# Altium project K-Line.PrjPcb
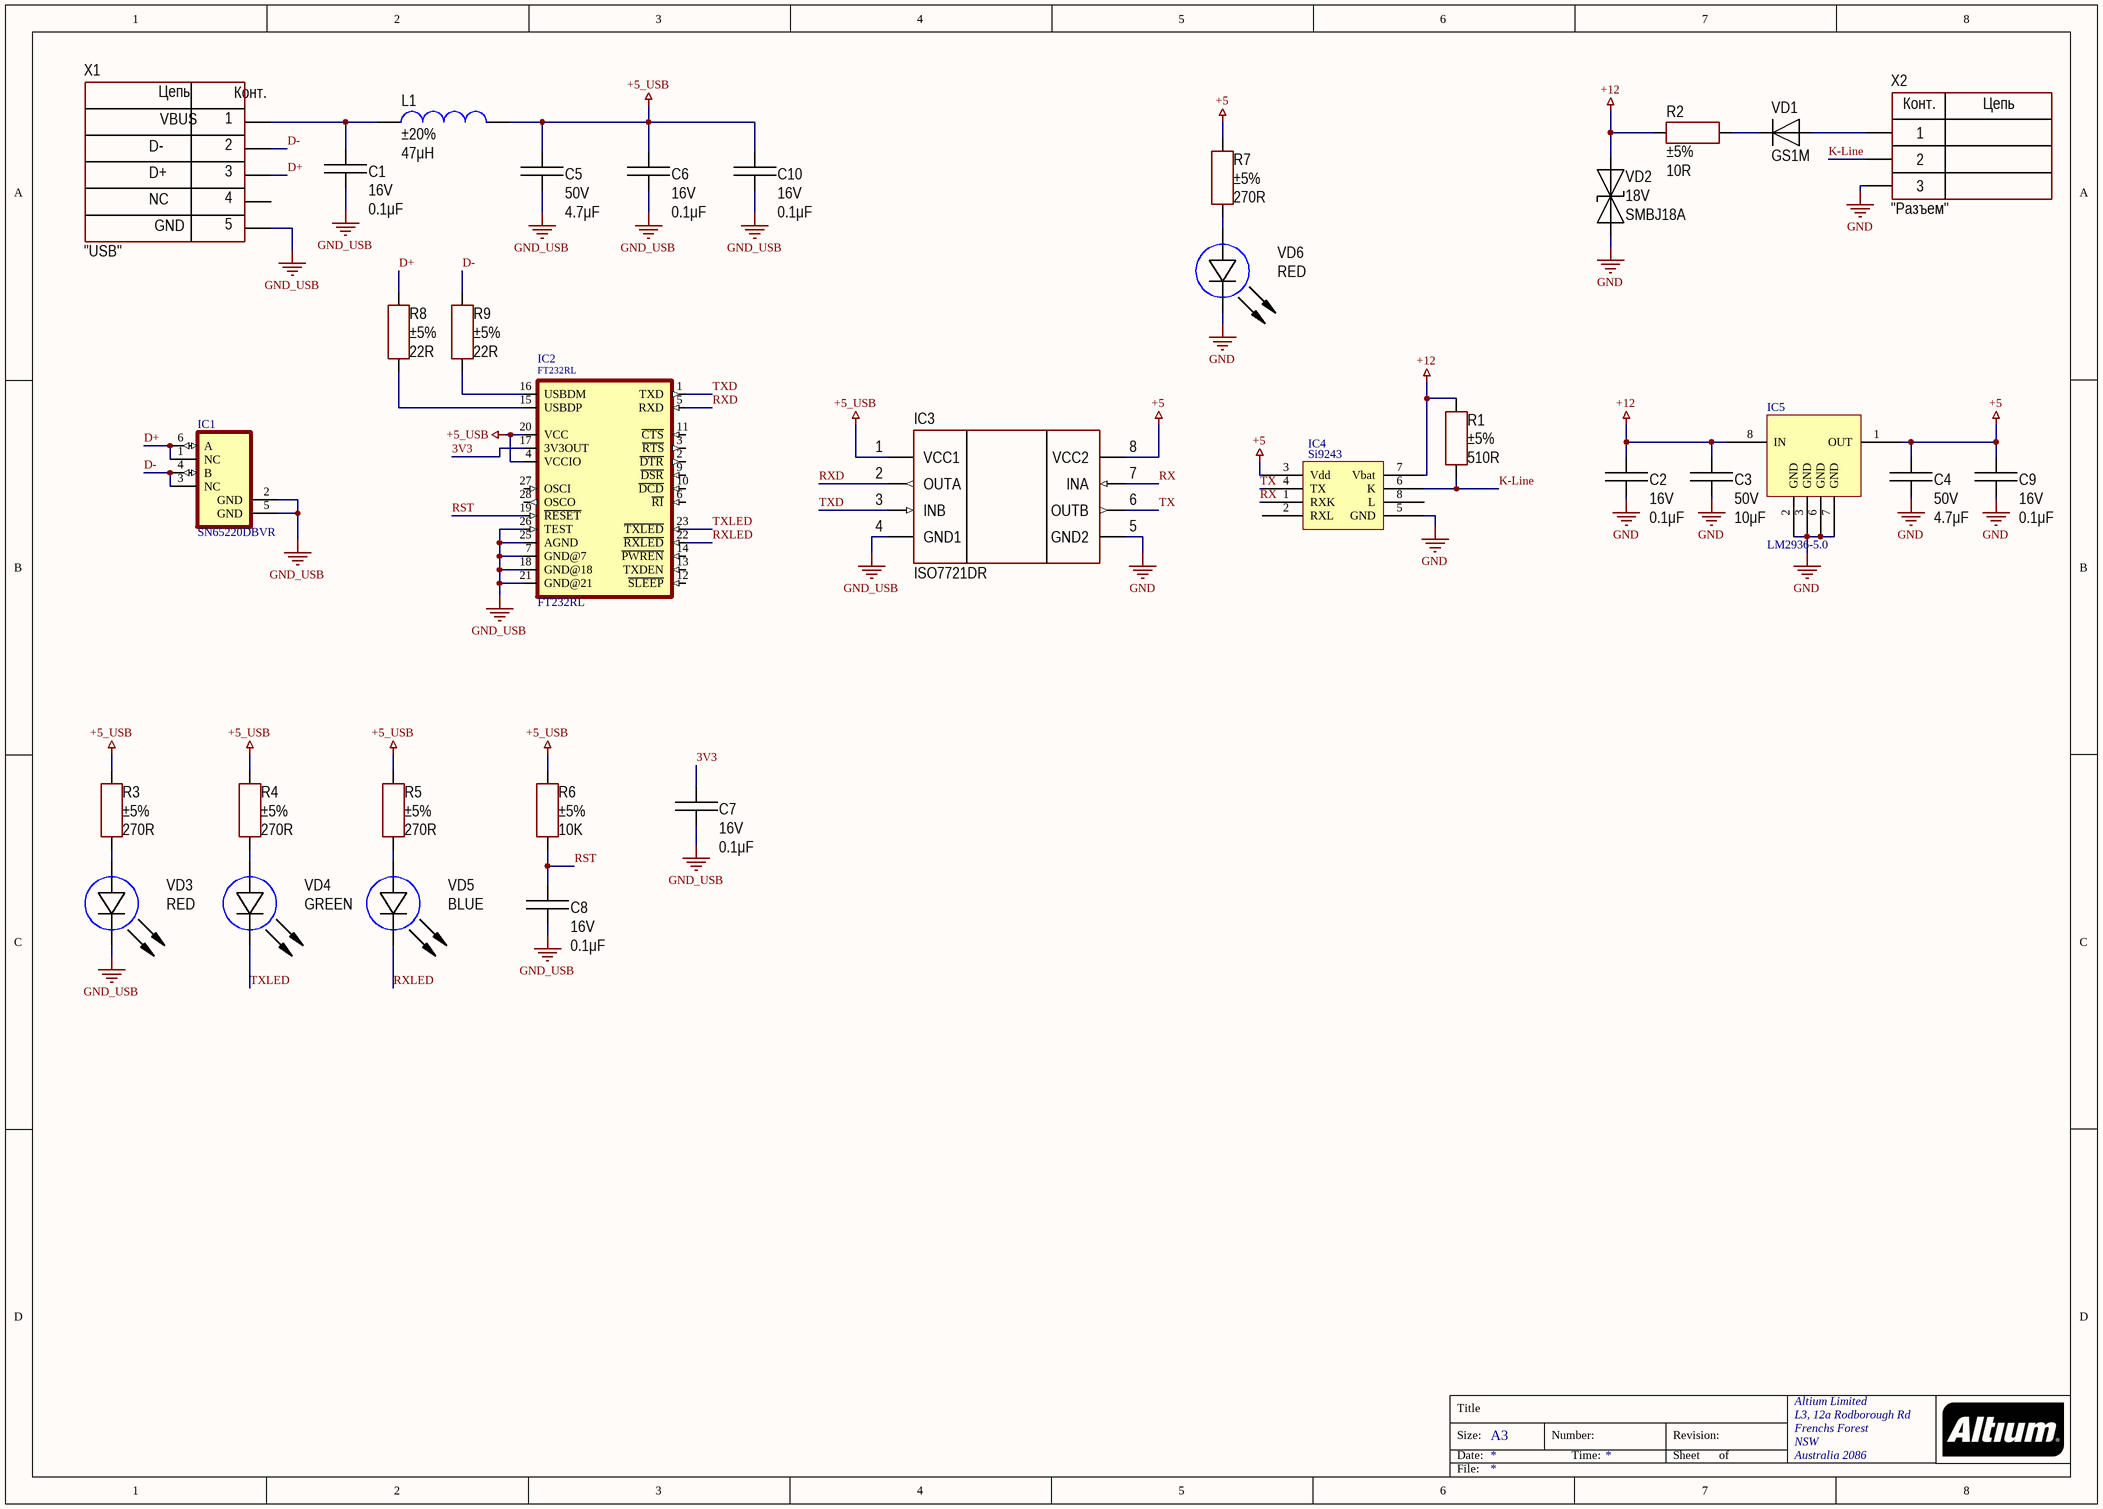
[diagram p0: K-Line.SchDoc]
1 sheet, 33 parts. Net scope: global (net labels, ports and power ports of the same name join across sheets).
Board file: PCB.PcbDoc

## Sheet K-Line.SchDoc
size A3; Organization: Altium Limited; Address1: L3, 12a Rodborough Rd; Address2: Frenchs Forest; Address3: NSW; Address4: Australia 2086

### Parts
C1  value 0.1μF  Voltage: 16V  [CAP: 0805]
C2  value 0.1μF  Voltage: 16V  [CAP: 0805]
C3  value 10μF  Voltage: 50V  [CAP: 1210]
C4  value 4.7μF  Voltage: 50V  [CAP: 1206]
C5  value 4.7μF  Voltage: 50V  [CAP: 1206]
C6  value 0.1μF  Voltage: 16V  [CAP: 0805]
C7  value 0.1μF  Voltage: 16V  [CAP: 0603]
C8  value 0.1μF  Voltage: 16V  [CAP: 0603]
C9  value 0.1μF  Voltage: 16V  [CAP: 0805]
C10  value 0.1μF  Voltage: 16V  [CAP: 0603]
IC1  SN65220DBVR  [SOT23-6]
IC2  FT232RL  [28-SSOP]
IC3  (no value)  [8-SOIC]
IC4  Si9243  [8-SOIC]
IC5  LM2936-5.0  [8-SOIC]
L1  value 47μH  Tolerance: ±20%  [IND: 0805]
R1  value 510R  Tolerance: ±5%  [RES: 2010]
R2  value 10R  Tolerance: ±5%  [RES: 1206]
R3  value 270R  Tolerance: ±5%  [RES: 0603]
R4  value 270R  Tolerance: ±5%  [RES: 0603]
R5  value 270R  Tolerance: ±5%  [RES: 0603]
R6  value 10K  Tolerance: ±5%  [RES: 0603]
R7  value 270R  Tolerance: ±5%  [RES: 0603]
R8  value 22R  Tolerance: ±5%  [RES: 0603]
R9  value 22R  Tolerance: ±5%  [RES: 0603]
VD1  PartNumber: GS1M  [DIODE: SMA]
VD2  Voltage: 18V  PartNumber: SMBJ18A  [DIODE: SMB]
VD3  Color: RED  [LED: 0402B]
VD4  Color: GREEN  [LED: 0402B]
VD5  Color: BLUE  [LED: 0402B]
VD6  Color: RED  [LED: 0402B]
X1  CommentText: "USB"  [CON: 0675031020]
X2  CommentText: "Разъем"  [CON: DG350-3.5-03P]

### Nets
+5: C4.2 C9.2 IC3.8(VCC2) IC4.3(Vdd) IC5.1(OUT) R7.2
+5_USB: C5.2 C6.2 C10.2 IC2.4(VCCIO) IC2.20(VCC) IC3.1(VCC1) L1.1 R3.2 R4.2 R5.2 R6.2
+12: C2.2 C3.2 IC4.7(Vbat) IC5.8(IN) R1.2 R2.1 VD2.2(C)
GND: C2.1 C3.1 C4.1 C9.1 IC3.5(GND2) IC4.5(GND) IC5.2(GND) IC5.3(GND) IC5.6(GND) IC5.7(GND) VD2.1(A) VD6.2(C) X2.3
GND_USB: C1.1 C5.1 C6.1 C7.1 C8.1 C10.1 IC1.2(GND) IC1.5(GND) IC2.7(GND@7) IC2.18(GND@18) IC2.21(GND@21) IC2.25(AGND) IC2.26(TEST) IC3.4(GND1) VD3.2(C) X1.5
3V3: C7.2 IC2.17(3V3OUT)
D+: IC1.1(NC) IC1.6(A) R8.2 X1.3
D-: IC1.3(NC) IC1.4(B) R9.2 X1.2
K-Line: IC4.6(K) R1.1 X2.2
RST: C8.2 IC2.19(~{RESET}) R6.1
RX: IC3.7(INA) IC4.1(RXK)
RXD: IC2.5(RXD) IC3.2(OUTA)
RXLED: IC2.22(~{RXLED}) VD5.2(C)
TX: IC3.6(OUTB) IC4.4(TX)
TXD: IC2.1(TXD) IC3.3(INB)
TXLED: IC2.23(~{TXLED}) VD4.2(C)
NetC1_2: C1.2 L1.2 X1.1
NetIC2_15: IC2.15(USBDP) R8.1
NetIC2_16: IC2.16(USBDM) R9.1
NetR2_2: R2.2 VD1.2
NetR3_1: R3.1 VD3.1(A)
NetR4_1: R4.1 VD4.1(A)
NetR5_1: R5.1 VD5.1(A)
NetR7_1: R7.1 VD6.1(A)
NetVD1_1: VD1.1 X2.1

Not connected (* = marked no-connect by the designer): IC2 2(~{DTR}) 3(~{RTS}) 6(~{RI}) 9(~{DSR}) 10(~{DCD}) 11(~{CTS}) 12(~{SLEEP}) 13(TXDEN) 14(~{PWREN}) 27(OSCI) 28(OSCO); IC4 2(RXL) 8(L); X1 4

### Notes on the sheet
- Title
- Size:
- Date:
- A3
- Number:
- Time:
- Revision:
- Sheet
- of
- File:
- (in symbol Connector_terminal_3pin) Конт.; Цепь
- (in symbol Connector_USB_mini_B) Цепь; Конт.; VBUS; D-; D+; NC; GND

### Library data of the parts
C1 C2 C6 C9 C10 = Ceramic_0805: Manufacturer: Yageo; PartNumber: CC0805KRX7R7BB104; ValueManufacturerPartNumber: Ceramic capacitor, 0.1μF, X7R, ±10%, 16V, 0805, -55...+125°C; TypeCapacitor: Ceramic capacitor; Tolerance: ±10%; TypeDielectric: X7R; Package: 0805; HelpURL: https://www.digikey.com/product-detail/en/yageo/CC0805KRX7R7BB104/311-1142-1-ND/303052; Temperature: -55...+125°C
C3 = Ceramic_1210: Manufacturer: Yageo; PartNumber: CC1210KKX7R9BB104; ValueManufacturerPartNumber: Ceramic capacitor, 10μF, X7R, ±10%, 50V, 1210, -55...+125°C; TypeCapacitor: Ceramic capacitor; Tolerance: ±10%; TypeDielectric: X7R; Package: 1210; HelpURL: https://www.digikey.com/product-detail/en/yageo/CC1210KKX7R9BB104/311-4522-1-ND/8025611; Temperature: -55...+125°C
C4 C5 = Ceramic_1206: Manufacturer: Yageo; PartNumber: CC1206KRX7R9BB104; ValueManufacturerPartNumber: Ceramic capacitor, 4.7μF, X7R, ±10%, 50V, 1206, -55...+125°C; TypeCapacitor: Ceramic capacitor; Tolerance: ±10%; TypeDielectric: X7R; Package: 1206; HelpURL: https://www.digikey.com/product-detail/en/yageo/CC1206KRX7R9BB104/311-1179-1-ND/303089; Temperature: -55...+125°C
C7 C8 = Ceramic_0603: Manufacturer: Yageo; PartNumber: CC0603KRX7R7BB104; ValueManufacturerPartNumber: Ceramic capacitor, 0.1μF, X7R, ±10%, 16V, 0603, -55...+125°C; TypeCapacitor: Ceramic capacitor; Tolerance: ±10%; TypeDielectric: X7R; Package: 0603; HelpURL: https://www.digikey.com/product-detail/en/yageo/CC0603KRX7R7BB104/311-1088-1-ND/302998; Temperature: -55...+125°C
IC1 = SN65220DBVR: IC SINGLE USB PORT TVS SOT-23-6; MF: Texas Instruments; Price: None; Value: *; MP: SN65220DBVR; Package: SOT-23-6 Texas Instruments; SnapEDA_Link: https://www.snapeda.com/parts/SN65220DBVR/Texas%20Instruments/view-part/214591/?ref=snap; Availability: Unavailable
IC2 = FT232RL: USB ë¸Œë¦¬ì§€, USB-UART USB 2.0 UART ì¸í„°íŽ˜ì´ìŠ¤ 28-SSOP; MF: FTDI, Future; Package: SSOP-28 FTDI, Future; Price: None; Availability: Unavailable; MP: FT232RL; SnapEDA_Link: https://www.snapeda.com/parts/FT232RL/FTDI%2C%20Future%20Technology%20Devices%20International%20Ltd/view-part/1077088/?ref=snap; Value: *
IC3 = ISO7721DR: Digital isolator; Manufacturer: Texas Instruments; ValueManufacturerPartNumber: IC digital isolator, 100Mbps, 3000Vrms, 2.25...5.5V, -55...+125°C, 8-SOIC; Supply: 2.25...5.5V; DataRate: 100Mbps; Isolation: 3000Vrms; HelpURL: https://www.digikey.com/product-detail/en/texas-instruments/ISO7721DR/296-48296-1-ND/8347715; Package: 8-SOIC; ComponentType: IC digital isolator; Temperature: -55...+125°C; PartNumber: ISO7721DR
L1 = Inductor_0805: Manufacturer: Murata Electronics; PartNumber: LQM21FN100M70L; ValueManufacturerPartNumber: Fixed inductor, 47μH, ±20%, 0805, 100mA, -55...+125°C; TypeInductor: Fixed inductor; MaxCurrent: 100mA; Package: 0805; HelpURL: https://www.digikey.com/product-detail/en/murata-electronics-north-america/LQM21FN100M70L/490-4029-1-ND/1016289; Temperature: -55...+125°C
R1 = Resistor_2010: Manufacturer: Yageo; PartNumber: RC2010JK-07100RL; ValueManufacturerPartNumber: Resistor film, 510R, ±5%, 2010, 0.75W, -55...+125°C; TypeResistor: Resistor film; Power: 0.75W; Package: 2010; HelpURL: https://www.digikey.com/product-detail/en/yageo/RC2010JK-07100RL/YAG3381CT-ND/5962203; Temperature: -55...+125°C
R2 = Resistor_1206: Manufacturer: Yageo; PartNumber: RC1206JR-07100RL; ValueManufacturerPartNumber: Resistor film, 10R, ±5%, 1206, 0.25W, -55...+125°C; TypeResistor: Resistor film; Power: 0.25W; Package: 1206; HelpURL: https://www.digikey.com/product-detail/en/yageo/RC1206JR-07100RL/311-100ERCT-ND/732153; Temperature: -55...+125°C
R3-R5 R7 = Resistor_0603: Manufacturer: Yageo; PartNumber: RC0603JR-07100RL; ValueManufacturerPartNumber: Resistor film, 270R, ±5%, 0603, 0.1W, -55...+125°C; TypeResistor: Resistor film; Power: 0.1W; Package: 0603; HelpURL: https://www.digikey.com/product-detail/en/yageo/RC0603JR-07100RL/311-100GRCT-ND/729644; Temperature: -55...+125°C
R6 = Resistor_0603: Manufacturer: Yageo; PartNumber: RC0603JR-07100RL; ValueManufacturerPartNumber: Resistor film, 10K, ±5%, 0603, 0.1W, -55...+125°C; TypeResistor: Resistor film; Power: 0.1W; Package: 0603; HelpURL: https://www.digikey.com/product-detail/en/yageo/RC0603JR-07100RL/311-100GRCT-ND/729644; Temperature: -55...+125°C
R8 R9 = Resistor_0603: Manufacturer: Yageo; PartNumber: RC0603JR-07100RL; ValueManufacturerPartNumber: Resistor film, 22R, ±5%, 0603, 0.1W, -55...+125°C; TypeResistor: Resistor film; Power: 0.1W; Package: 0603; HelpURL: https://www.digikey.com/product-detail/en/yageo/RC0603JR-07100RL/311-100GRCT-ND/729644; Temperature: -55...+125°C
VD1 = Diode_single: Manufacturer: Micro Commercial; ValueManufacturerPartNumber: Single diode, 75V, 150mA, 1V, 4ns, SOD-323, -55...+150°C; TypeDiode: Single diode; Voltage: 75V; Current: 150mA; VoltageDrop: 1V; RecoveryTime: 4ns; Package: SOD-323; HelpURL: https://www.digikey.com/product-detail/en/micro-commercial-co/1N4148WX-TP/1N4148WXTPMSCT-ND/717312; Temperature: -55...+150°C
VD2 = TVS_single: Manufacturer: Diodes Incorporated; ValueManufacturerPartNumber: Zener diode, 18V, 500mW, 0.9V, 17Ohm, SOD-123, -55...+150°C; TypeDiode: Zener diode; Current: 500mW; VoltageDrop: 0.9V; RecoveryTime: 17Ohm; Package: SOD-123; HelpURL: https://www.digikey.com/product-detail/en/diodes-incorporated/MMSZ5231B-7-F/MMSZ5231B-FDICT-ND/755506; Temperature: -55...+150°C
VD3-VD6 = LED_single: ValueManufacturerPartNumber: LED, *, *, *, -55...+150°C; TypeDiode: LED; Manufacturer: *; Package: *; HelpURL: *; Temperature: -55...+150°C; Current: *; VoltageDrop: *; PartNumber: *
X1 = Connector_USB_mini_B: Manufacturer: Molex; ValueManufacturerPartNumber: USB mini B; PartNumber: 0675031020; HelpURL: https://www.digikey.com/product-detail/en/molex/0675031020/WM5461CT-ND/1624427; TypeConnector: USB mini B
X2 = Connector_terminal_3pin: Manufacturer: Degson; ValueManufacturerPartNumber: Terminal connector, 3pin, 3.5mm, 300VAC, 10A; PartNumber: DG350-3.5-03P-14; TypeConnector: Terminal connector; VoltageMax: 300VAC; Pitch: 3.5mm; CurrentMax: 10A; Multichannel: 3pin; HelpURL: https://www.chipdip.ru/product/dg350-3.5-03p-12